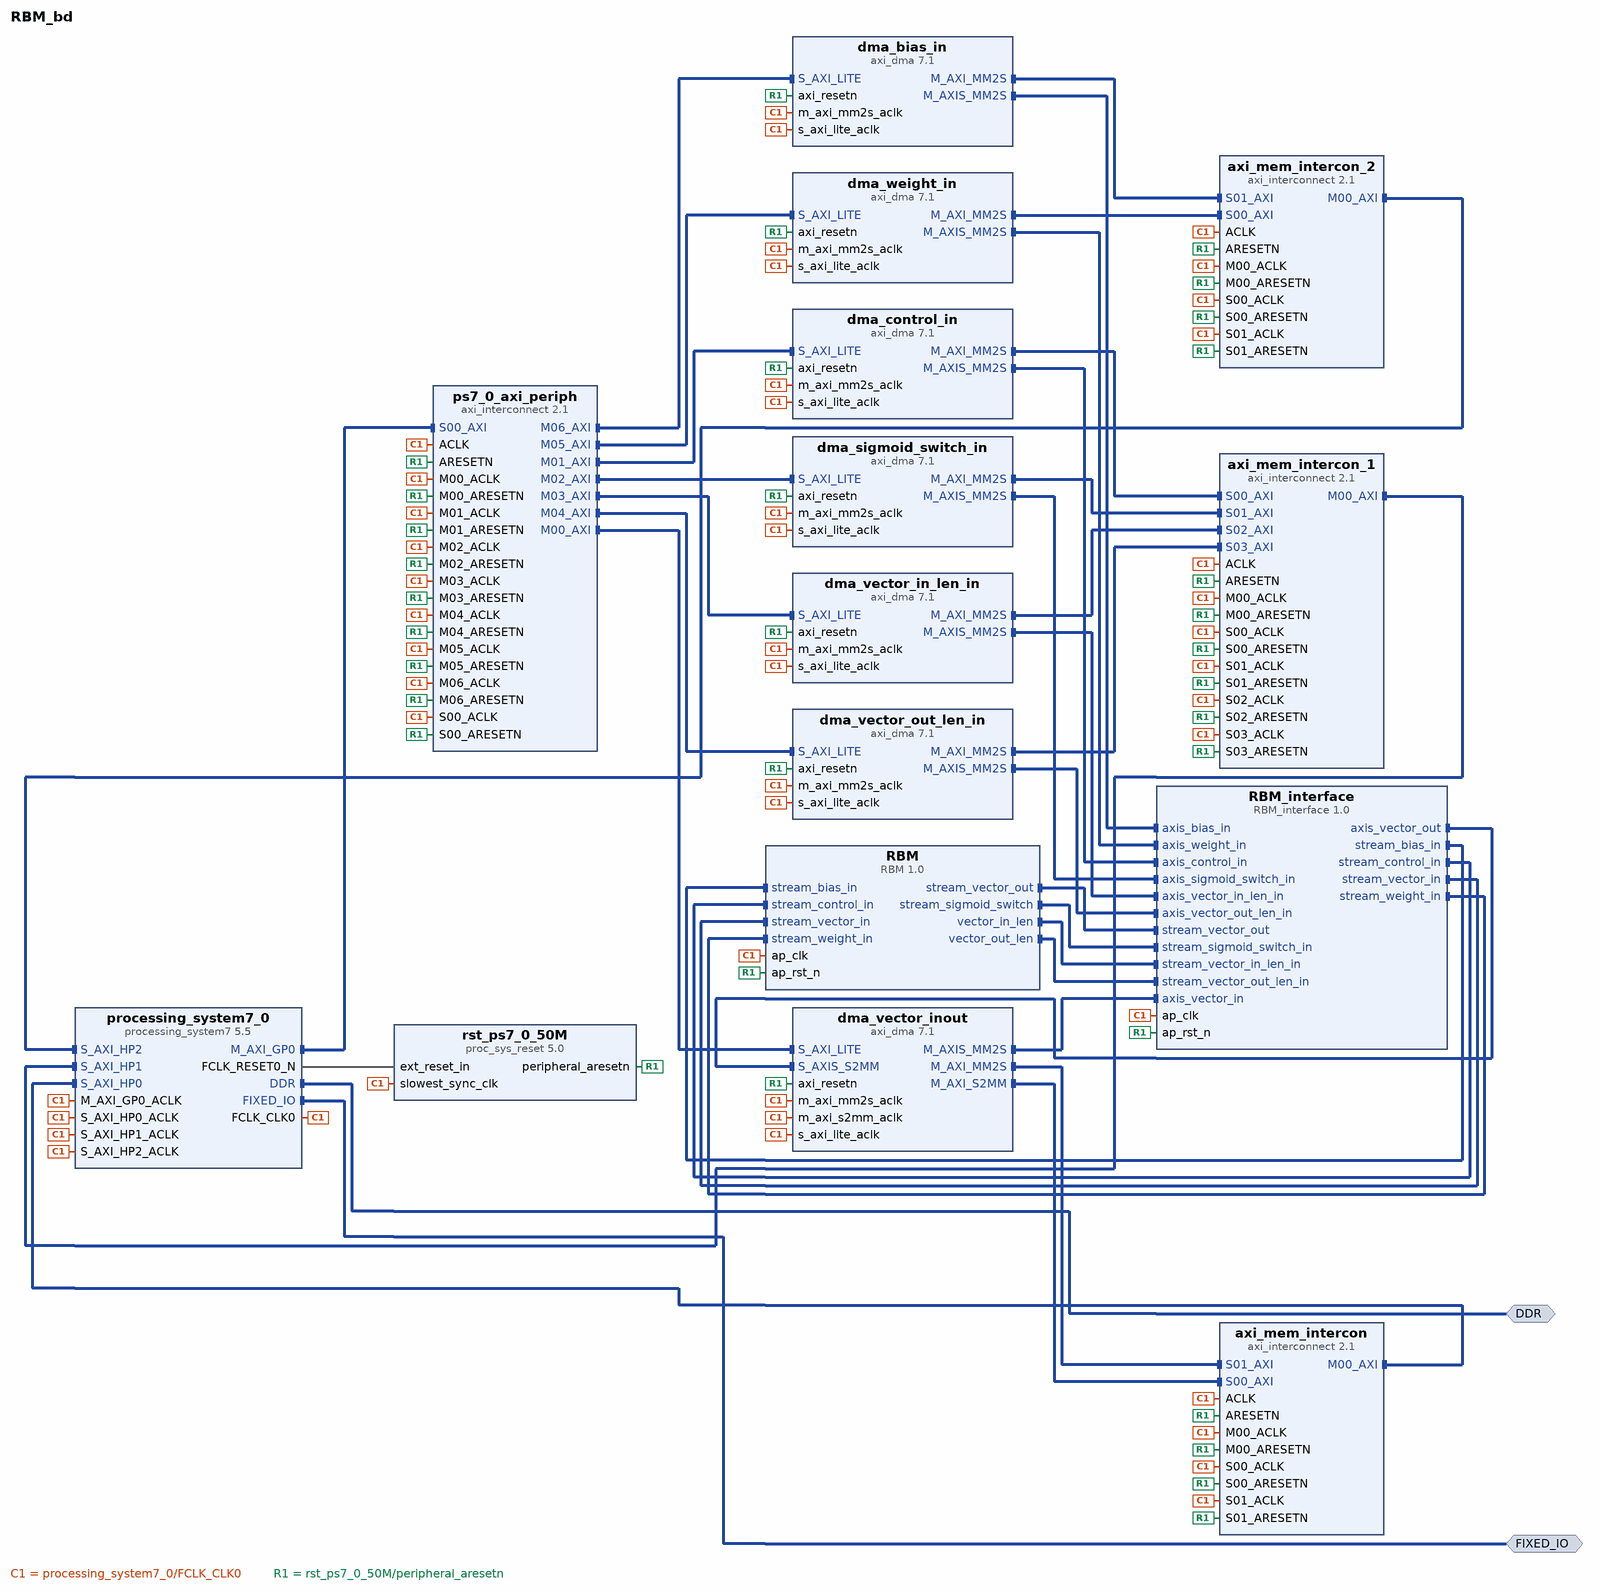
[diagram p0: block diagram of the top level]
# Vivado block design RBM_bd, xc7z020clg400-1, Vivado 2022.2
create_bd_design RBM_bd

create_bd_intf_port -mode Master -vlnv xilinx.com:interface:ddrx_rtl:1.0 DDR
create_bd_intf_port -mode Master -vlnv xilinx.com:display_processing_system7:fixedio_rtl:1.0 FIXED_IO

create_bd_cell -type ip -vlnv xilinx.com:hls:RBM_interface:1.0 RBM_interface
create_bd_cell -type ip -vlnv xilinx.com:ip:processing_system7:5.5 processing_system7_0
set_property -dict [list \
  CONFIG.PCW_FPGA0_PERIPHERAL_FREQMHZ 80 \
  CONFIG.PCW_USE_S_AXI_HP0 1 \
  CONFIG.PCW_USE_S_AXI_HP1 1 \
  CONFIG.PCW_USE_S_AXI_HP2 1 \
] [get_bd_cells processing_system7_0]
# 30 more settings of processing_system7_0 are not shown: defaults, MIO pin electricals, DDR timing, and values the tool derives
create_bd_cell -type ip -vlnv xilinx.com:ip:proc_sys_reset:5.0 rst_ps7_0_50M
create_bd_cell -type ip -vlnv xilinx.com:ip:axi_dma:7.1 dma_vector_inout
set_property -dict [list \
  CONFIG.c_include_mm2s_dre 1 \
  CONFIG.c_include_s2mm_dre 1 \
  CONFIG.c_include_sg 0 \
  CONFIG.c_m_axi_mm2s_data_width 64 \
  CONFIG.c_m_axis_mm2s_tdata_width 16 \
  CONFIG.c_mm2s_burst_size 256 \
  CONFIG.c_s2mm_burst_size 256 \
  CONFIG.c_sg_length_width 26 \
] [get_bd_cells dma_vector_inout]
create_bd_cell -type ip -vlnv xilinx.com:ip:axi_interconnect:2.1 axi_mem_intercon
set_property -dict {CONFIG.NUM_MI 1 CONFIG.NUM_SI 2} [get_bd_cells axi_mem_intercon]
create_bd_cell -type ip -vlnv xilinx.com:ip:axi_dma:7.1 dma_control_in
set_property -dict [list \
  CONFIG.c_include_mm2s_dre 1 \
  CONFIG.c_include_s2mm 0 \
  CONFIG.c_include_sg 0 \
  CONFIG.c_m_axi_mm2s_data_width 64 \
  CONFIG.c_m_axis_mm2s_tdata_width 8 \
  CONFIG.c_mm2s_burst_size 256 \
] [get_bd_cells dma_control_in]
create_bd_cell -type ip -vlnv xilinx.com:ip:axi_interconnect:2.1 axi_mem_intercon_1
set_property -dict {CONFIG.NUM_MI 1 CONFIG.NUM_SI 4} [get_bd_cells axi_mem_intercon_1]
create_bd_cell -type ip -vlnv xilinx.com:ip:axi_dma:7.1 dma_sigmoid_switch_in
set_property -dict [list \
  CONFIG.c_include_mm2s_dre 1 \
  CONFIG.c_include_s2mm 0 \
  CONFIG.c_include_sg 0 \
  CONFIG.c_m_axi_mm2s_data_width 64 \
  CONFIG.c_m_axis_mm2s_tdata_width 8 \
  CONFIG.c_mm2s_burst_size 256 \
] [get_bd_cells dma_sigmoid_switch_in]
create_bd_cell -type ip -vlnv xilinx.com:ip:axi_dma:7.1 dma_vector_in_len_in
set_property -dict [list \
  CONFIG.c_include_mm2s_dre 1 \
  CONFIG.c_include_s2mm 0 \
  CONFIG.c_include_sg 0 \
  CONFIG.c_m_axi_mm2s_data_width 64 \
  CONFIG.c_m_axis_mm2s_tdata_width 16 \
  CONFIG.c_mm2s_burst_size 256 \
] [get_bd_cells dma_vector_in_len_in]
create_bd_cell -type ip -vlnv xilinx.com:ip:axi_dma:7.1 dma_vector_out_len_in
set_property -dict [list \
  CONFIG.c_include_mm2s_dre 1 \
  CONFIG.c_include_s2mm 0 \
  CONFIG.c_include_sg 0 \
  CONFIG.c_m_axi_mm2s_data_width 64 \
  CONFIG.c_m_axis_mm2s_tdata_width 16 \
  CONFIG.c_mm2s_burst_size 256 \
] [get_bd_cells dma_vector_out_len_in]
create_bd_cell -type ip -vlnv xilinx.com:ip:axi_dma:7.1 dma_weight_in
set_property -dict [list \
  CONFIG.c_include_mm2s_dre 1 \
  CONFIG.c_include_s2mm 0 \
  CONFIG.c_include_sg 0 \
  CONFIG.c_m_axi_mm2s_data_width 64 \
  CONFIG.c_m_axis_mm2s_tdata_width 32 \
  CONFIG.c_mm2s_burst_size 256 \
  CONFIG.c_sg_length_width 24 \
] [get_bd_cells dma_weight_in]
create_bd_cell -type ip -vlnv xilinx.com:ip:axi_interconnect:2.1 axi_mem_intercon_2
set_property -dict {CONFIG.NUM_MI 1 CONFIG.NUM_SI 2} [get_bd_cells axi_mem_intercon_2]
create_bd_cell -type ip -vlnv xilinx.com:ip:axi_dma:7.1 dma_bias_in
set_property -dict [list \
  CONFIG.c_include_mm2s_dre 1 \
  CONFIG.c_include_s2mm 0 \
  CONFIG.c_include_sg 0 \
  CONFIG.c_m_axi_mm2s_data_width 64 \
  CONFIG.c_m_axis_mm2s_tdata_width 32 \
  CONFIG.c_mm2s_burst_size 256 \
  CONFIG.c_sg_length_width 24 \
] [get_bd_cells dma_bias_in]
create_bd_cell -type ip -vlnv xilinx.com:ip:axi_interconnect:2.1 ps7_0_axi_periph
set_property -dict {CONFIG.NUM_MI 7} [get_bd_cells ps7_0_axi_periph]
create_bd_cell -type ip -vlnv xilinx.com:hls:RBM:1.0 RBM

# ---- connections ----

connect_bd_intf_net -intf_net RBM_0_stream_vector_out [get_bd_intf_pins RBM/stream_vector_out] [get_bd_intf_pins RBM_interface/stream_vector_out]
connect_bd_intf_net -intf_net RBM_interface_0_stream_bias_in [get_bd_intf_pins RBM_interface/stream_bias_in] [get_bd_intf_pins RBM/stream_bias_in]
connect_bd_intf_net -intf_net RBM_interface_0_stream_control_in [get_bd_intf_pins RBM_interface/stream_control_in] [get_bd_intf_pins RBM/stream_control_in]
connect_bd_intf_net -intf_net RBM_interface_0_stream_sigmoid_switch_in [get_bd_intf_pins RBM_interface/stream_sigmoid_switch_in] [get_bd_intf_pins RBM/stream_sigmoid_switch]
connect_bd_intf_net -intf_net RBM_interface_0_stream_vector_in [get_bd_intf_pins RBM_interface/stream_vector_in] [get_bd_intf_pins RBM/stream_vector_in]
connect_bd_intf_net -intf_net RBM_interface_0_stream_vector_in_len_in [get_bd_intf_pins RBM_interface/stream_vector_in_len_in] [get_bd_intf_pins RBM/vector_in_len]
connect_bd_intf_net -intf_net RBM_interface_0_stream_vector_out_len_in [get_bd_intf_pins RBM_interface/stream_vector_out_len_in] [get_bd_intf_pins RBM/vector_out_len]
connect_bd_intf_net -intf_net RBM_interface_0_stream_weight_in [get_bd_intf_pins RBM_interface/stream_weight_in] [get_bd_intf_pins RBM/stream_weight_in]
connect_bd_intf_net [get_bd_intf_pins RBM_interface/axis_vector_out] [get_bd_intf_pins dma_vector_inout/S_AXIS_S2MM]
connect_bd_intf_net -intf_net axi_dma_1_M_AXIS_MM2S [get_bd_intf_pins RBM_interface/axis_control_in] [get_bd_intf_pins dma_control_in/M_AXIS_MM2S]
connect_bd_intf_net -intf_net axi_dma_1_M_AXI_MM2S [get_bd_intf_pins dma_control_in/M_AXI_MM2S] [get_bd_intf_pins axi_mem_intercon_1/S00_AXI]
connect_bd_intf_net -intf_net axi_dma_2_M_AXIS_MM2S [get_bd_intf_pins RBM_interface/axis_sigmoid_switch_in] [get_bd_intf_pins dma_sigmoid_switch_in/M_AXIS_MM2S]
connect_bd_intf_net -intf_net axi_dma_2_M_AXI_MM2S [get_bd_intf_pins dma_sigmoid_switch_in/M_AXI_MM2S] [get_bd_intf_pins axi_mem_intercon_1/S01_AXI]
connect_bd_intf_net -intf_net axi_dma_3_M_AXIS_MM2S [get_bd_intf_pins RBM_interface/axis_vector_in_len_in] [get_bd_intf_pins dma_vector_in_len_in/M_AXIS_MM2S]
connect_bd_intf_net -intf_net axi_dma_3_M_AXI_MM2S [get_bd_intf_pins dma_vector_in_len_in/M_AXI_MM2S] [get_bd_intf_pins axi_mem_intercon_1/S02_AXI]
connect_bd_intf_net -intf_net axi_dma_4_M_AXIS_MM2S [get_bd_intf_pins RBM_interface/axis_vector_out_len_in] [get_bd_intf_pins dma_vector_out_len_in/M_AXIS_MM2S]
connect_bd_intf_net -intf_net axi_dma_4_M_AXI_MM2S [get_bd_intf_pins dma_vector_out_len_in/M_AXI_MM2S] [get_bd_intf_pins axi_mem_intercon_1/S03_AXI]
connect_bd_intf_net -intf_net axi_dma_5_M_AXIS_MM2S [get_bd_intf_pins RBM_interface/axis_weight_in] [get_bd_intf_pins dma_weight_in/M_AXIS_MM2S]
connect_bd_intf_net -intf_net axi_dma_5_M_AXI_MM2S [get_bd_intf_pins dma_weight_in/M_AXI_MM2S] [get_bd_intf_pins axi_mem_intercon_2/S00_AXI]
connect_bd_intf_net -intf_net axi_dma_6_M_AXIS_MM2S [get_bd_intf_pins RBM_interface/axis_bias_in] [get_bd_intf_pins dma_bias_in/M_AXIS_MM2S]
connect_bd_intf_net -intf_net axi_dma_6_M_AXI_MM2S [get_bd_intf_pins dma_bias_in/M_AXI_MM2S] [get_bd_intf_pins axi_mem_intercon_2/S01_AXI]
connect_bd_intf_net -intf_net axi_dma_M_AXIS_MM2S [get_bd_intf_pins RBM_interface/axis_vector_in] [get_bd_intf_pins dma_vector_inout/M_AXIS_MM2S]
connect_bd_intf_net -intf_net axi_dma_M_AXI_MM2S [get_bd_intf_pins dma_vector_inout/M_AXI_MM2S] [get_bd_intf_pins axi_mem_intercon/S01_AXI]
connect_bd_intf_net -intf_net axi_dma_M_AXI_S2MM [get_bd_intf_pins dma_vector_inout/M_AXI_S2MM] [get_bd_intf_pins axi_mem_intercon/S00_AXI]
connect_bd_intf_net [get_bd_intf_pins axi_mem_intercon_1/M00_AXI] [get_bd_intf_pins processing_system7_0/S_AXI_HP1]
connect_bd_intf_net [get_bd_intf_pins axi_mem_intercon_2/M00_AXI] [get_bd_intf_pins processing_system7_0/S_AXI_HP2]
connect_bd_intf_net [get_bd_intf_pins axi_mem_intercon/M00_AXI] [get_bd_intf_pins processing_system7_0/S_AXI_HP0]
connect_bd_intf_net [get_bd_intf_ports DDR] [get_bd_intf_pins processing_system7_0/DDR]
connect_bd_intf_net [get_bd_intf_ports FIXED_IO] [get_bd_intf_pins processing_system7_0/FIXED_IO]
connect_bd_intf_net [get_bd_intf_pins processing_system7_0/M_AXI_GP0] [get_bd_intf_pins ps7_0_axi_periph/S00_AXI]
connect_bd_intf_net [get_bd_intf_pins ps7_0_axi_periph/M00_AXI] [get_bd_intf_pins dma_vector_inout/S_AXI_LITE]
connect_bd_intf_net [get_bd_intf_pins ps7_0_axi_periph/M01_AXI] [get_bd_intf_pins dma_control_in/S_AXI_LITE]
connect_bd_intf_net [get_bd_intf_pins ps7_0_axi_periph/M02_AXI] [get_bd_intf_pins dma_sigmoid_switch_in/S_AXI_LITE]
connect_bd_intf_net [get_bd_intf_pins ps7_0_axi_periph/M03_AXI] [get_bd_intf_pins dma_vector_in_len_in/S_AXI_LITE]
connect_bd_intf_net [get_bd_intf_pins ps7_0_axi_periph/M04_AXI] [get_bd_intf_pins dma_vector_out_len_in/S_AXI_LITE]
connect_bd_intf_net [get_bd_intf_pins ps7_0_axi_periph/M05_AXI] [get_bd_intf_pins dma_weight_in/S_AXI_LITE]
connect_bd_intf_net [get_bd_intf_pins ps7_0_axi_periph/M06_AXI] [get_bd_intf_pins dma_bias_in/S_AXI_LITE]
connect_bd_net [get_bd_pins processing_system7_0/FCLK_CLK0] \
  [get_bd_pins RBM_interface/ap_clk] [get_bd_pins rst_ps7_0_50M/slowest_sync_clk] \
  [get_bd_pins dma_vector_inout/m_axi_s2mm_aclk] [get_bd_pins axi_mem_intercon/S00_ACLK] \
  [get_bd_pins processing_system7_0/S_AXI_HP0_ACLK] [get_bd_pins axi_mem_intercon/M00_ACLK] \
  [get_bd_pins axi_mem_intercon/ACLK] [get_bd_pins dma_vector_inout/m_axi_mm2s_aclk] [get_bd_pins axi_mem_intercon/S01_ACLK] \
  [get_bd_pins dma_control_in/m_axi_mm2s_aclk] [get_bd_pins axi_mem_intercon_1/S00_ACLK] \
  [get_bd_pins processing_system7_0/S_AXI_HP1_ACLK] [get_bd_pins axi_mem_intercon_1/M00_ACLK] \
  [get_bd_pins axi_mem_intercon_1/ACLK] [get_bd_pins dma_sigmoid_switch_in/m_axi_mm2s_aclk] \
  [get_bd_pins axi_mem_intercon_1/S01_ACLK] [get_bd_pins dma_vector_in_len_in/m_axi_mm2s_aclk] \
  [get_bd_pins axi_mem_intercon_1/S02_ACLK] [get_bd_pins dma_vector_out_len_in/m_axi_mm2s_aclk] \
  [get_bd_pins axi_mem_intercon_1/S03_ACLK] [get_bd_pins dma_weight_in/m_axi_mm2s_aclk] \
  [get_bd_pins axi_mem_intercon_2/S00_ACLK] [get_bd_pins processing_system7_0/S_AXI_HP2_ACLK] \
  [get_bd_pins axi_mem_intercon_2/M00_ACLK] [get_bd_pins axi_mem_intercon_2/ACLK] [get_bd_pins dma_bias_in/m_axi_mm2s_aclk] \
  [get_bd_pins axi_mem_intercon_2/S01_ACLK] [get_bd_pins processing_system7_0/M_AXI_GP0_ACLK] \
  [get_bd_pins ps7_0_axi_periph/S00_ACLK] [get_bd_pins dma_vector_inout/s_axi_lite_aclk] \
  [get_bd_pins ps7_0_axi_periph/M00_ACLK] [get_bd_pins ps7_0_axi_periph/ACLK] [get_bd_pins dma_control_in/s_axi_lite_aclk] \
  [get_bd_pins ps7_0_axi_periph/M01_ACLK] [get_bd_pins dma_sigmoid_switch_in/s_axi_lite_aclk] \
  [get_bd_pins ps7_0_axi_periph/M02_ACLK] [get_bd_pins dma_vector_in_len_in/s_axi_lite_aclk] \
  [get_bd_pins ps7_0_axi_periph/M03_ACLK] [get_bd_pins dma_vector_out_len_in/s_axi_lite_aclk] \
  [get_bd_pins ps7_0_axi_periph/M04_ACLK] [get_bd_pins dma_weight_in/s_axi_lite_aclk] [get_bd_pins ps7_0_axi_periph/M05_ACLK] \
  [get_bd_pins dma_bias_in/s_axi_lite_aclk] [get_bd_pins ps7_0_axi_periph/M06_ACLK] [get_bd_pins RBM/ap_clk]
connect_bd_net [get_bd_pins processing_system7_0/FCLK_RESET0_N] [get_bd_pins rst_ps7_0_50M/ext_reset_in]
connect_bd_net [get_bd_pins rst_ps7_0_50M/peripheral_aresetn] \
  [get_bd_pins RBM_interface/ap_rst_n] [get_bd_pins axi_mem_intercon/S00_ARESETN] [get_bd_pins axi_mem_intercon/M00_ARESETN] \
  [get_bd_pins axi_mem_intercon/ARESETN] [get_bd_pins axi_mem_intercon/S01_ARESETN] \
  [get_bd_pins axi_mem_intercon_1/S00_ARESETN] [get_bd_pins axi_mem_intercon_1/M00_ARESETN] \
  [get_bd_pins axi_mem_intercon_1/ARESETN] [get_bd_pins axi_mem_intercon_1/S01_ARESETN] \
  [get_bd_pins axi_mem_intercon_1/S02_ARESETN] [get_bd_pins axi_mem_intercon_1/S03_ARESETN] \
  [get_bd_pins axi_mem_intercon_2/S00_ARESETN] [get_bd_pins axi_mem_intercon_2/M00_ARESETN] \
  [get_bd_pins axi_mem_intercon_2/ARESETN] [get_bd_pins axi_mem_intercon_2/S01_ARESETN] \
  [get_bd_pins ps7_0_axi_periph/S00_ARESETN] [get_bd_pins dma_vector_inout/axi_resetn] \
  [get_bd_pins ps7_0_axi_periph/M00_ARESETN] [get_bd_pins ps7_0_axi_periph/ARESETN] [get_bd_pins dma_control_in/axi_resetn] \
  [get_bd_pins ps7_0_axi_periph/M01_ARESETN] [get_bd_pins dma_sigmoid_switch_in/axi_resetn] \
  [get_bd_pins ps7_0_axi_periph/M02_ARESETN] [get_bd_pins dma_vector_in_len_in/axi_resetn] \
  [get_bd_pins ps7_0_axi_periph/M03_ARESETN] [get_bd_pins dma_vector_out_len_in/axi_resetn] \
  [get_bd_pins ps7_0_axi_periph/M04_ARESETN] [get_bd_pins dma_weight_in/axi_resetn] \
  [get_bd_pins ps7_0_axi_periph/M05_ARESETN] [get_bd_pins dma_bias_in/axi_resetn] [get_bd_pins ps7_0_axi_periph/M06_ARESETN] \
  [get_bd_pins RBM/ap_rst_n]

# ---- address map ----
assign_bd_address -offset 0x00000000 -range 512M -target_address_space [get_bd_addr_spaces dma_bias_in/Data_MM2S] [get_bd_addr_segs processing_system7_0/S_AXI_HP2/HP2_DDR_LOWOCM]
assign_bd_address -offset 0x00000000 -range 512M -target_address_space [get_bd_addr_spaces dma_control_in/Data_MM2S] [get_bd_addr_segs processing_system7_0/S_AXI_HP1/HP1_DDR_LOWOCM]
assign_bd_address -offset 0x00000000 -range 512M -target_address_space [get_bd_addr_spaces dma_sigmoid_switch_in/Data_MM2S] [get_bd_addr_segs processing_system7_0/S_AXI_HP1/HP1_DDR_LOWOCM]
assign_bd_address -offset 0x00000000 -range 512M -target_address_space [get_bd_addr_spaces dma_vector_in_len_in/Data_MM2S] [get_bd_addr_segs processing_system7_0/S_AXI_HP1/HP1_DDR_LOWOCM]
assign_bd_address -offset 0x00000000 -range 512M -target_address_space [get_bd_addr_spaces dma_vector_inout/Data_MM2S] [get_bd_addr_segs processing_system7_0/S_AXI_HP0/HP0_DDR_LOWOCM]
assign_bd_address -offset 0x00000000 -range 512M -target_address_space [get_bd_addr_spaces dma_vector_inout/Data_S2MM] [get_bd_addr_segs processing_system7_0/S_AXI_HP0/HP0_DDR_LOWOCM]
assign_bd_address -offset 0x00000000 -range 512M -target_address_space [get_bd_addr_spaces dma_vector_out_len_in/Data_MM2S] [get_bd_addr_segs processing_system7_0/S_AXI_HP1/HP1_DDR_LOWOCM]
assign_bd_address -offset 0x00000000 -range 512M -target_address_space [get_bd_addr_spaces dma_weight_in/Data_MM2S] [get_bd_addr_segs processing_system7_0/S_AXI_HP2/HP2_DDR_LOWOCM]
assign_bd_address -offset 0x41E00000 -range 64K -target_address_space [get_bd_addr_spaces processing_system7_0/Data] [get_bd_addr_segs dma_vector_inout/S_AXI_LITE/Reg]
assign_bd_address -offset 0x41E10000 -range 64K -target_address_space [get_bd_addr_spaces processing_system7_0/Data] [get_bd_addr_segs dma_control_in/S_AXI_LITE/Reg]
assign_bd_address -offset 0x41E20000 -range 64K -target_address_space [get_bd_addr_spaces processing_system7_0/Data] [get_bd_addr_segs dma_sigmoid_switch_in/S_AXI_LITE/Reg]
assign_bd_address -offset 0x41E30000 -range 64K -target_address_space [get_bd_addr_spaces processing_system7_0/Data] [get_bd_addr_segs dma_vector_in_len_in/S_AXI_LITE/Reg]
assign_bd_address -offset 0x41E40000 -range 64K -target_address_space [get_bd_addr_spaces processing_system7_0/Data] [get_bd_addr_segs dma_vector_out_len_in/S_AXI_LITE/Reg]
assign_bd_address -offset 0x41E50000 -range 64K -target_address_space [get_bd_addr_spaces processing_system7_0/Data] [get_bd_addr_segs dma_weight_in/S_AXI_LITE/Reg]
assign_bd_address -offset 0x41E60000 -range 64K -target_address_space [get_bd_addr_spaces processing_system7_0/Data] [get_bd_addr_segs dma_bias_in/S_AXI_LITE/Reg]

validate_bd_design
save_bd_design
